# EAGLE schematic 102_buzzer (EAGLE 9.1.0)
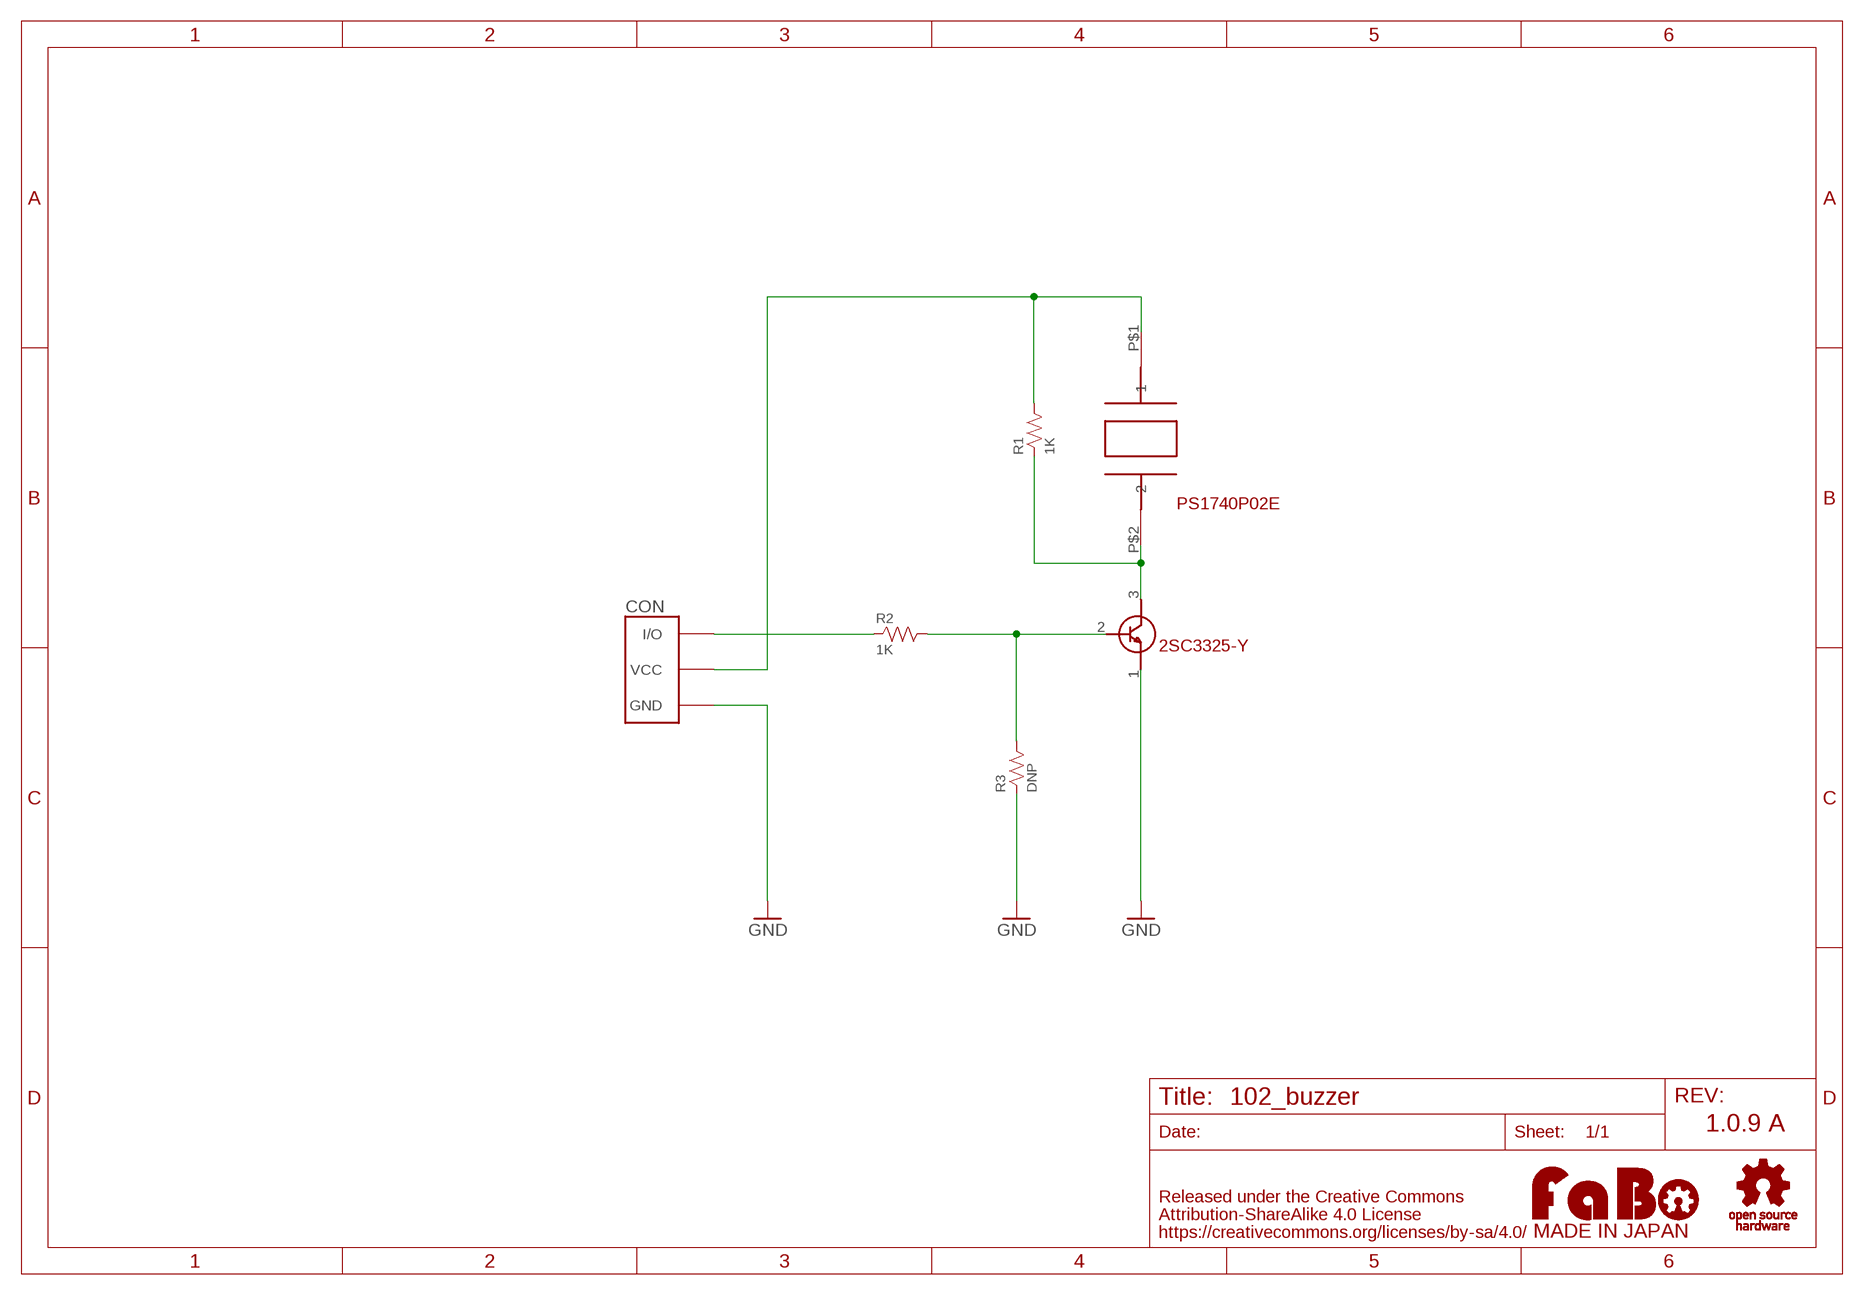
[diagram p0: schematic, sheet 1]

## Parts
CON  FABO_BRICK_3PIN_INNER  [FABO_BRICK_3PIN_HOLE_CON]
R1  1K  RESISTOR-0603  [0603]
R2  1K  RESISTOR-0603  [0603]
R3  DNP  RESISTOR-0603  [0603]
T1  2SC3325-Y  [SC-59]
U1  PS1740P02E  [PS1740P02E]
U$2  LOGO_FABO-M  [LOGO_FABO_MS]
U$3  LOGO_OSHW-M_BOTTOM  [LOGO_OSHW_M_BOTTOM]

## Nets
GND: CON.GND R3.1 T1.1(E)
N$1: CON.I/O R2.1
N$2: CON.VCC R1.2 U1.P$1
N$3: R1.1 T1.3(C) U1.P$2
N$5: R2.2 R3.2 T1.2(B)

## Notes on the sheet
- PS1740P02E
- 1.0.9 A

## Library data of the parts
CON = FaBo-Template 3:FABO_BRICK_3PIN_INNER
R1-R3 = FaBo-Resistors:RESISTOR: RESISTOR
T1 = FaBo-Transistor:2SC3325-Y
U1 = FaBo:PS1740P02E
U$2 = FaBo-etc:LOGO_FABO
U$3 = FaBo-etc:LOGO_OSHW